# EAGLE board driver_board (EAGLE 6.4)
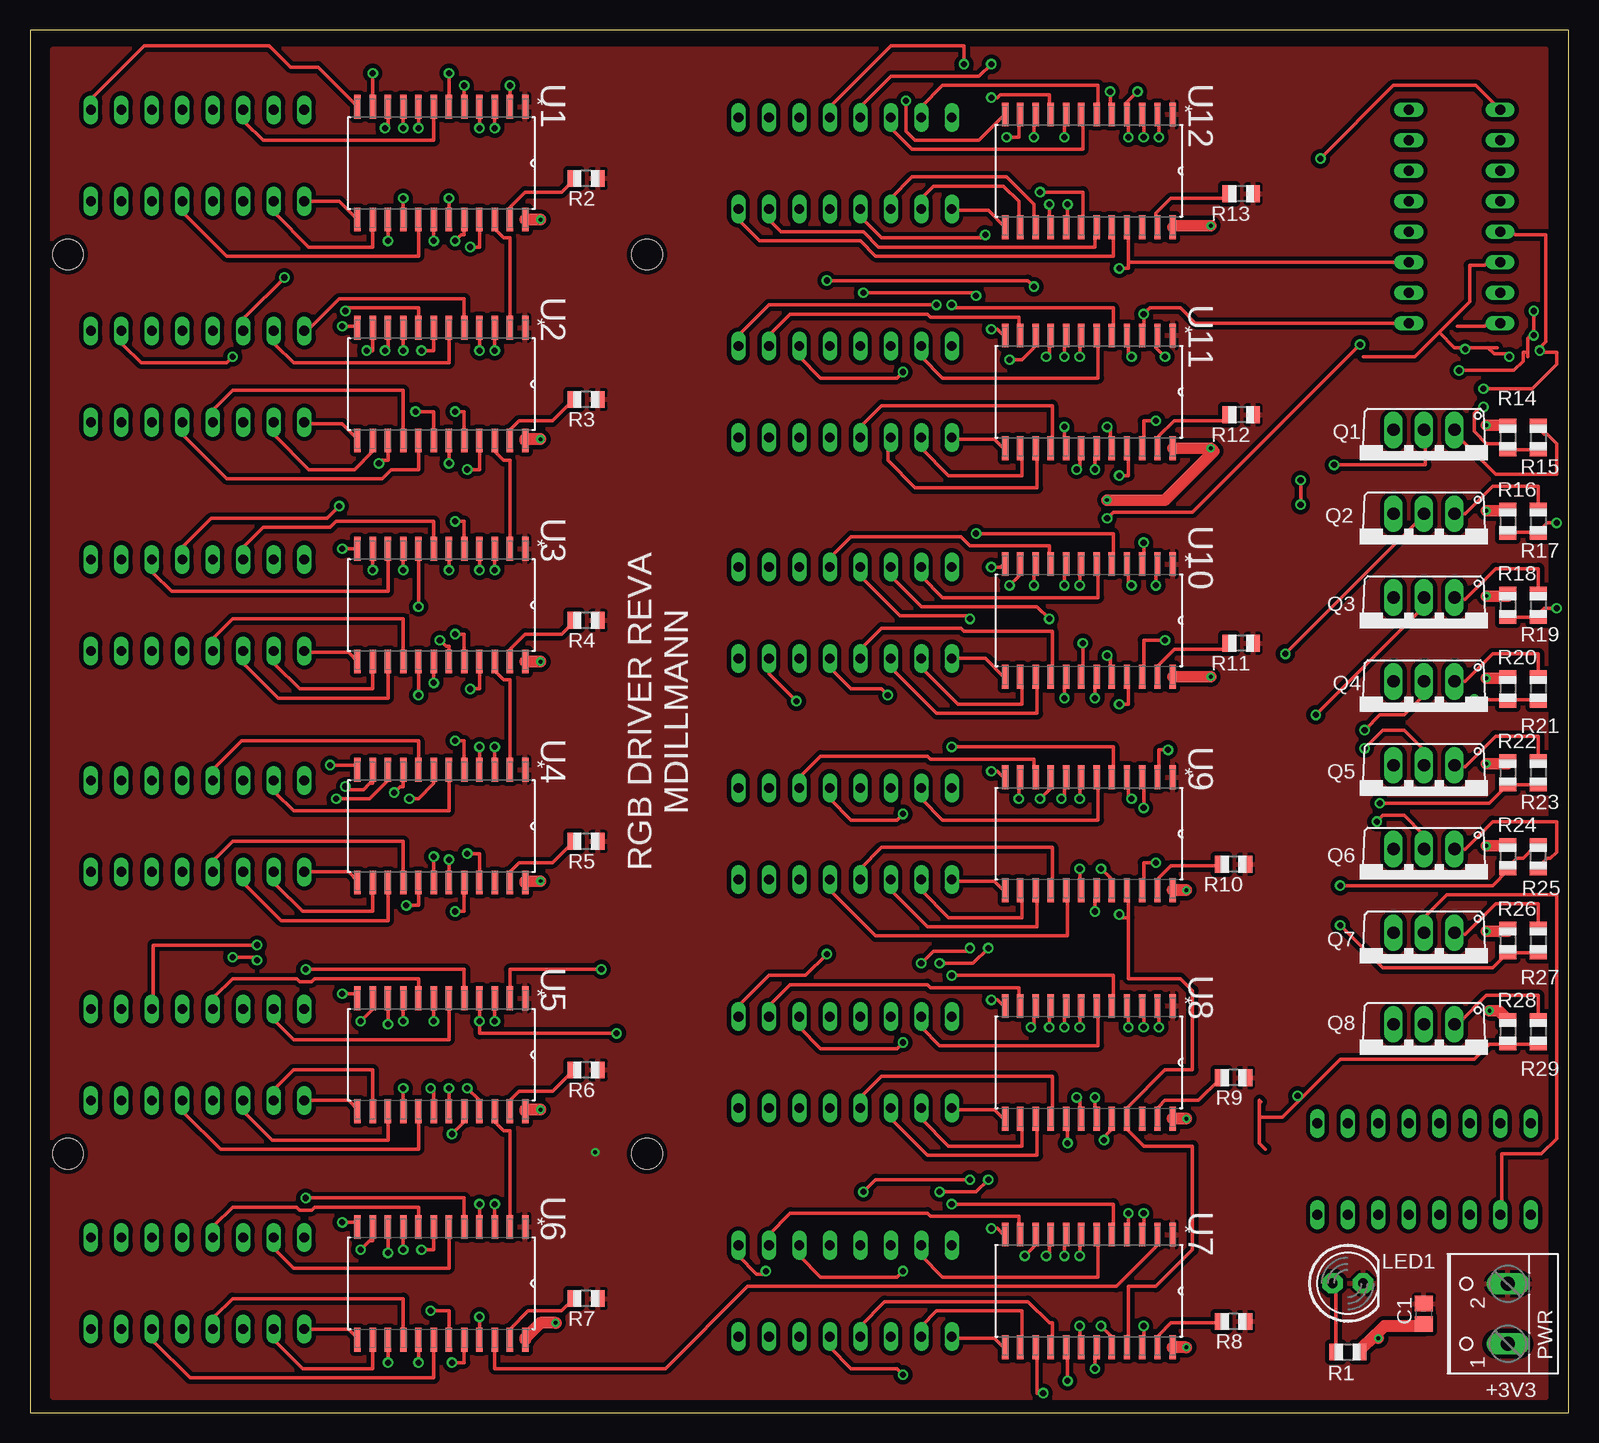
[diagram p2: board, top side]
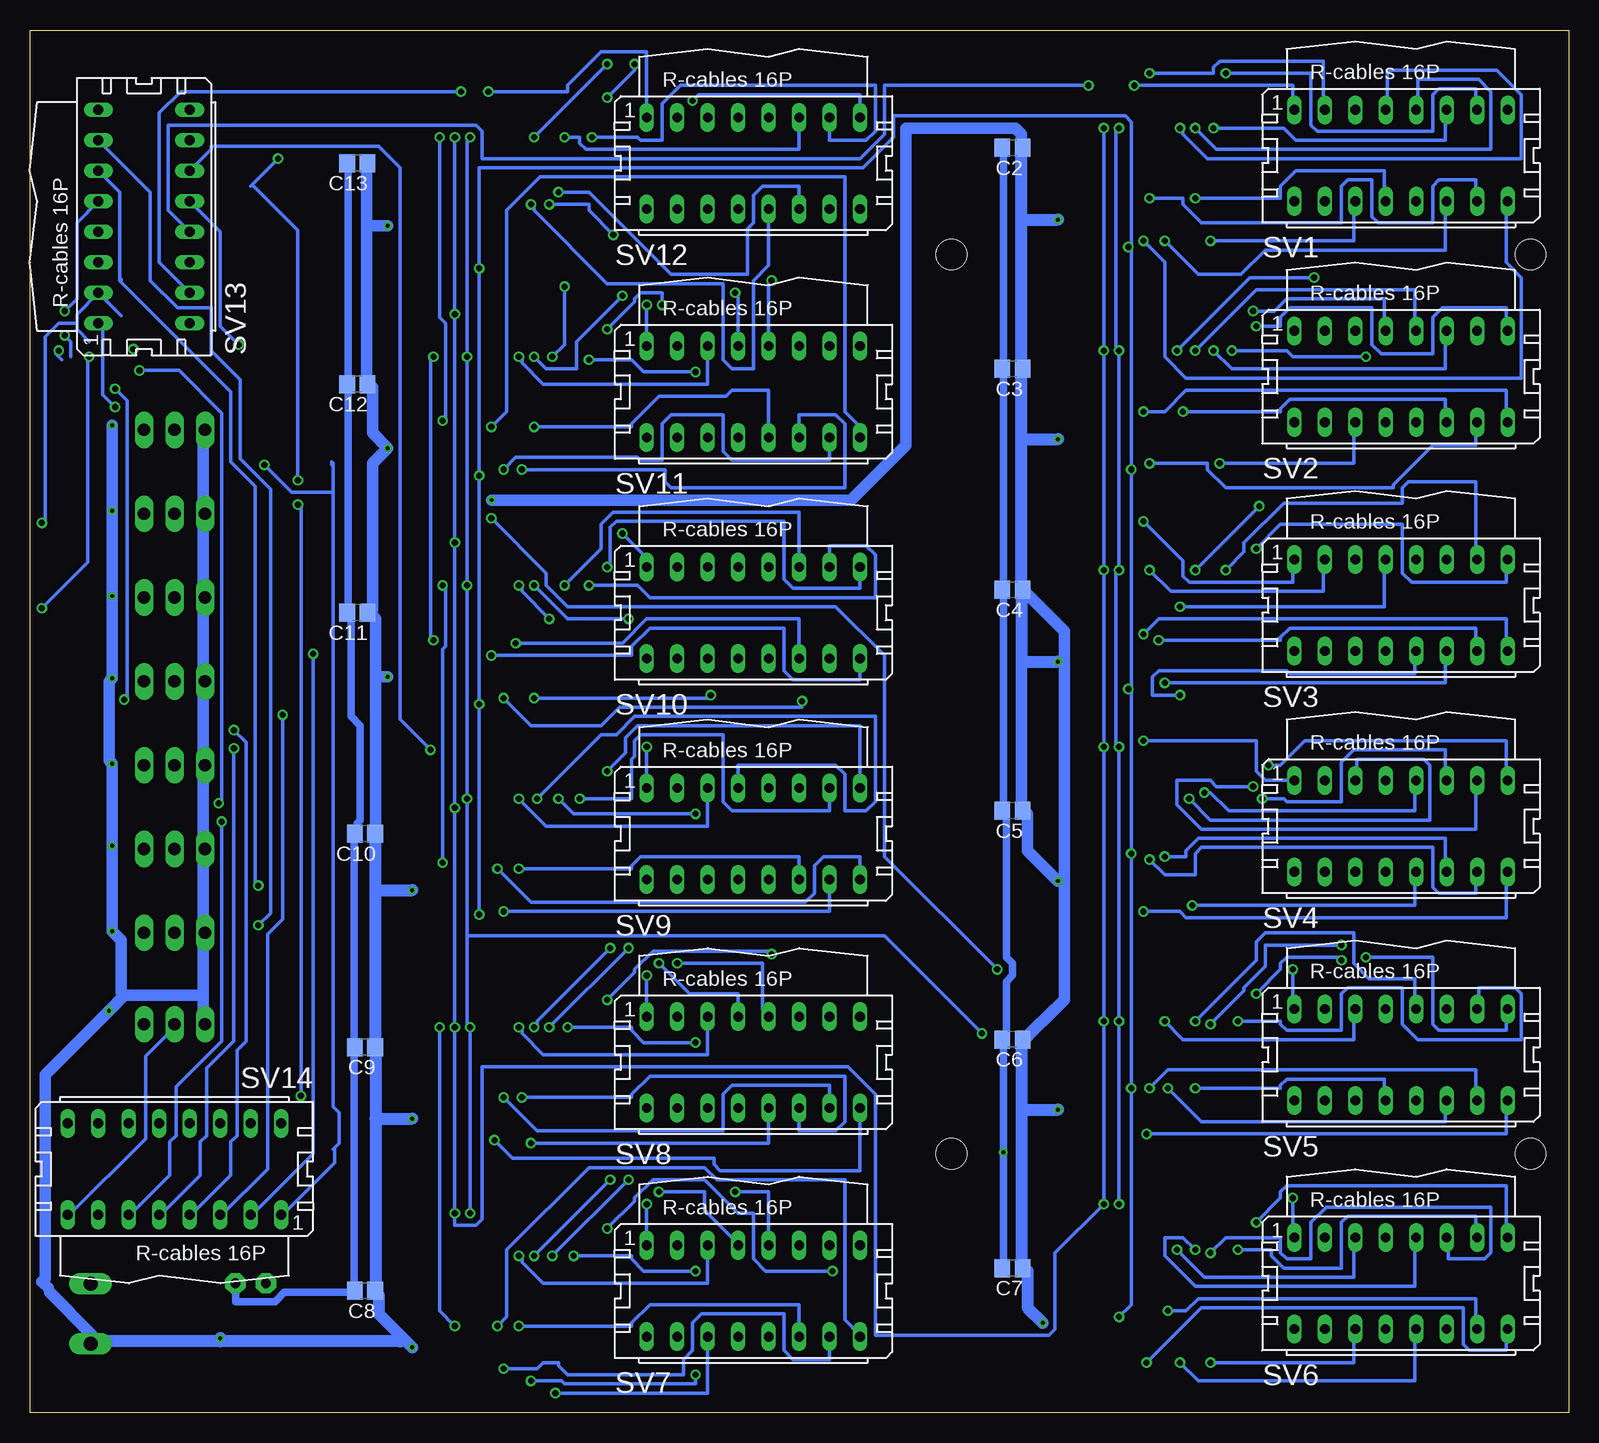
[diagram p3: board, bottom side, seen from below]

Size 128.25 x 115.24 mm. Coordinates in mm from the lower left corner, seen from the top.
Outline: 0,0 128.25,0 128.25,115.24 0,115.24 0,0
Copper layers (1*16): Top 0.0356mm / dielectric 1.5011mm / Bottom 0.0356mm
Design rules "LaenPCBOrder": minimum track width 6mil, minimum drill 13mil, track to track 6mil, track to pad 6mil, pad to pad 6mil, via to via 6mil, smd to smd 6mil, copper to edge 15mil, drill to drill 6mil, minimum pad ring 7mil, minimum via ring 7mil, stop-mask expansion 3mil, vias tented up to drill 0mil, thermal gap 10mil
Net classes: 0 default: width 0.305 mm, drill 0.508 mm, clearance 0.355 mm; 1 GND: width 0.61 mm, clearance 0.355 mm to class 0, clearance 0.355 mm; 2 +3V3: width 0.965 mm, clearance 0.355 mm to class 0, clearance 0.355 mm to class 1, clearance 0.355 mm
Holes 2.54 mm at 3.17,96.52 3.17,21.59 51.44,21.59 51.44,96.52

## Footprints (pad centres in the part's own frame; a part is rotated, then mirrored left to right if it is on the bottom)
C0805 = smd 1.3 x 1.5: 1 -0.85,0; 2 0.85,0
LED5MM = drill 0.813 pad 1.676 octagon: A -1.27,0; K 1.27,0
W237-102 = drill 1.194 long: 1 -2.5,-1.27; 2 2.5,-1.27
TO220AV = drill 1.016 long: B -2.54,-2.54; C 0,-2.54; E 2.54,-2.54
R0805 = smd 1.1 x 1.4: 1 -1,0; 2 1,0
16PL = drill 0.813 long: 1 -8.89,3.81; 2 -8.89,-3.81; 3 -6.35,3.81; 4 -6.35,-3.81; 5 -3.81,3.81; 6 -3.81,-3.81; 7 -1.27,3.81; 8 -1.27,-3.81; 9 1.27,3.81; 10 1.27,-3.81; 11 3.81,3.81; 12 3.81,-3.81; 13 6.35,3.81; 14 6.35,-3.81; 15 8.89,3.81; 16 8.89,-3.81
SOIC127P1032X265-24N = smd 1.981 x 0.533: 1 -4.699,6.985; 2 -4.699,5.715; 3 -4.699,4.445; 4 -4.699,3.175; 5 -4.699,1.905; 6 -4.699,0.635; 7 -4.699,-0.635; 8 -4.699,-1.905; 9 -4.699,-3.175; 10 -4.699,-4.445; 11 -4.699,-5.715; 12 -4.699,-6.985; 13 4.699,-6.985; 14 4.699,-5.715; 15 4.699,-4.445; 16 4.699,-3.175; 17 4.699,-1.905; 18 4.699,-0.635; 19 4.699,0.635; 20 4.699,1.905; 21 4.699,3.175; 22 4.699,4.445; 23 4.699,5.715; 24 4.699,6.985

## Placement (x,y rotation side)
C1  0.01  [C0805]  116.2,8.26 90 top
C2  [C0805]  46.35,105.41 180 bottom
C3  [C0805]  46.35,87 180 bottom
C4  [C0805]  46.35,68.58 180 bottom
C5  [C0805]  46.35,50.16 180 bottom
C6  [C0805]  46.35,31.11 180 bottom
C7  [C0805]  46.35,12.06 180 bottom
C8  [C0805]  100.33,10.16 180 bottom
C9  [C0805]  100.33,30.48 180 bottom
C10  [C0805]  100.33,48.26 180 bottom
C11  [C0805]  100.97,66.67 180 bottom
C12  [C0805]  100.97,85.72 180 bottom
C13  [C0805]  100.97,104.14 180 bottom
LED1  GREEN  [LED5MM]  109.86,10.79 0 top
PWR  [W237-102]  121.92,8.26 90 top
Q1  TIP32  [TO220AV]  116.2,79.38 180 top
Q2  TIP32  [TO220AV]  116.2,72.39 180 top
Q3  TIP32  [TO220AV]  116.2,65.41 180 top
Q4  TIP32  [TO220AV]  116.2,58.42 180 top
Q5  TIP32  [TO220AV]  116.2,51.44 180 top
Q6  TIP32  [TO220AV]  116.2,44.45 180 top
Q7  TIP32  [TO220AV]  116.2,37.47 180 top
Q8  TIP32  [TO220AV]  116.2,29.84 180 top
R1  220  [R0805]  109.86,5.08 0 top
R2  1K  [R0805]  46.35,102.87 180 top
R3  1K  [R0805]  46.35,84.45 180 top
R4  1K  [R0805]  46.35,66.04 180 top
R5  1K  [R0805]  46.35,47.62 180 top
R6  1K  [R0805]  46.35,28.57 180 top
R7  1K  [R0805]  46.35,9.53 180 top
R8  1K  [R0805]  100.33,7.62 180 top
R9  1K  [R0805]  100.33,27.94 180 top
R10  1K  [R0805]  100.33,45.72 180 top
R11  1K  [R0805]  100.97,64.14 180 top
R12  1K  [R0805]  100.97,83.19 180 top
R13  1K  [R0805]  100.97,101.6 180 top
R14  2K  [R0805]  123.19,81.28 270 top
R15  1K  [R0805]  125.73,81.28 270 top
R16  2K  [R0805]  123.19,74.3 270 top
R17  1K  [R0805]  125.73,74.3 270 top
R18  2K  [R0805]  123.19,67.31 270 top
R19  1K  [R0805]  125.73,67.31 270 top
R20  2K  [R0805]  123.19,60.33 270 top
R21  1K  [R0805]  125.73,60.33 270 top
R22  2K  [R0805]  123.19,53.34 270 top
R23  1K  [R0805]  125.73,53.34 270 top
R24  2K  [R0805]  123.19,46.35 270 top
R25  1K  [R0805]  125.73,46.35 90 top
R26  2K  [R0805]  123.19,39.37 270 top
R27  1K  [R0805]  125.73,39.37 270 top
R28  2K  [R0805]  123.19,31.75 270 top
R29  1K  [R0805]  125.73,31.75 270 top
SV1  [16PL]  13.97,104.78 0 bottom
SV2  [16PL]  13.97,86.36 0 bottom
SV3  [16PL]  13.97,67.31 0 bottom
SV4  [16PL]  13.97,48.9 0 bottom
SV5  [16PL]  13.97,29.84 0 bottom
SV6  [16PL]  13.97,10.79 0 bottom
SV7  [16PL]  67.94,10.16 0 bottom
SV8  [16PL]  67.94,29.21 0 bottom
SV9  [16PL]  67.94,48.26 0 bottom
SV10  [16PL]  67.94,66.67 0 bottom
SV11  [16PL]  67.94,85.09 0 bottom
SV12  [16PL]  67.94,104.14 0 bottom
SV13  [16PL]  118.75,99.69 90 bottom
SV14  [16PL]  116.2,20.32 180 bottom
U1  STP16CPP05MTR  [SOIC127P1032X265-24N]  34.29,104.14 270 top
U2  STP16CPP05MTR  [SOIC127P1032X265-24N]  34.29,85.72 270 top
U3  STP16CPP05MTR  [SOIC127P1032X265-24N]  34.29,67.31 270 top
U4  STP16CPP05MTR  [SOIC127P1032X265-24N]  34.29,48.9 270 top
U5  STP16CPP05MTR  [SOIC127P1032X265-24N]  34.29,29.84 270 top
U6  STP16CPP05MTR  [SOIC127P1032X265-24N]  34.29,10.79 270 top
U7  STP16CPP05MTR  [SOIC127P1032X265-24N]  88.27,10.16 270 top
U8  STP16CPP05MTR  [SOIC127P1032X265-24N]  88.27,29.21 270 top
U9  STP16CPP05MTR  [SOIC127P1032X265-24N]  88.27,48.26 270 top
U10  STP16CPP05MTR  [SOIC127P1032X265-24N]  88.27,66.04 270 top
U11  STP16CPP05MTR  [SOIC127P1032X265-24N]  88.27,85.09 270 top
U12  STP16CPP05MTR  [SOIC127P1032X265-24N]  88.27,103.5 270 top

## Tracks (layer width: path | path; a pad name or v marks a point on that pad's centre or on a via)
+3V3  (via drill 0.33)
  Top 0.965: U11.24 v98.42,80.39 98.68,80.14 94.61,76.07 v89.79,76.07 | v98.42,98.93 95.38,98.93 U12.24 | v98.42,61.34 U10.24 | v42.55,44.32 41.27,44.32 U4.24 | v121.67,33.53 122.43,33.53 123.19,32.77 R28.1 | v121.41,40.13 123.19,40.13 R26.1 | v121.41,47.24 123.19,47.24 R24.1 | v121.41,54.1 123.19,54.1 R22.1 | v121.41,61.21 123.19,61.21 R20.1 | v121.41,68.07 123.19,68.07 R18.1 | v121.41,75.18 123.19,75.18 R16.1 | v121.41,82.3 123.19,82.3 R14.1
  Top 1.016: v43.81,7.49 42.55,7.49 41.27,6.22 U6.24 | v42.55,25.27 41.27,25.27 U5.24 | v42.55,62.61 U3.24 | v42.55,81.15 41.27,81.15 U2.24 | v42.55,99.44 U1.24 | 112.14,6.48 112.9,7.24 116.2,7.24 C1.1 | 112.14,6.48 110.87,5.21 R1.2 | v96.39,5.46 U7.24 | v96.39,24.51 U8.24 | v96.39,43.56 U9.24 | v112.39,6.22 112.14,6.48
  Bottom 0.965: 100.2,98.93 100.2,104.01 C13.1 | 100.2,98.93 100.2,85.72 C12.1 99.69,85.47 99.69,81.66 v98.42,80.39 99.69,79.12 99.69,66.93 C11.1 99.95,66.67 99.44,66.17 99.44,61.34 | 100.2,98.93 v98.42,98.93 | 99.44,61.34 99.44,48.64 C10.1 | 99.44,61.34 v98.42,61.34 | PWR.1 123.06,6.48 126.62,10.03 126.75,10.41 127.25,10.92 127,11.18 127,28.19 v121.67,33.53 120.4,34.8 | v89.79,76.07 59.82,76.07 55.24,80.64 55.24,107.06 46.1,107.06 45.59,106.55 45.59,105.79 C2.1 | 45.59,62.61 45.59,50.16 C5.1 45.09,49.91 45.09,46.86 v42.55,44.32 | 42.8,33.66 42.04,34.42 42.04,65.15 45.34,68.45 C4.1 | 113.79,34.8 120.4,34.8 | 113.79,34.8 113.79,32.51 Q8.E | 120.4,34.8 120.65,35.05 120.65,39.37 v121.41,40.13 v121.41,47.24 v121.41,54.1 121.67,54.36 121.67,60.96 v121.41,61.21 v121.41,68.07 v121.41,75.18 v121.41,82.3 | 113.79,34.8 113.79,39.88 Q7.E 113.79,40.39 113.79,46.99 Q6.E 113.79,47.24 113.79,53.85 Q5.E 113.79,54.36 113.79,60.96 Q4.E 113.79,61.21 113.79,67.82 Q3.E 113.79,68.33 113.79,74.93 Q2.E 113.79,75.18 113.79,81.79 Q1.E
  Bottom 1.016: 45.59,25.27 45.59,31.11 C6.1 45.09,31.37 42.8,33.66 | 45.59,25.27 45.59,12.06 C7.1 45.09,11.81 45.09,8.76 v43.81,7.49 | 45.59,25.27 v42.55,25.27 | 45.59,81.15 45.59,68.96 C4.1 45.59,68.45 45.59,62.61 v42.55,62.61 | 45.59,81.15 45.59,87 C3.1 45.59,87.25 45.59,99.44 | 45.59,99.44 45.59,105.28 C2.1 | 45.59,81.15 v42.55,81.15 | 45.59,99.44 v42.55,99.44 | 99.44,24.51 99.44,30.35 C9.1 99.44,30.86 99.44,43.56 | 99.44,24.51 99.44,10.29 C8.1 99.19,9.78 99.19,8.26 97.16,6.22 | 99.44,43.56 99.44,48.13 C10.1 | 97.16,6.22 v96.39,5.46 | 99.44,24.51 v96.39,24.51 | 99.44,43.56 v96.39,43.56 | 112.39,5.97 97.41,5.97 97.16,6.22 | 112.39,5.97 123.06,5.97 PWR.1 | v112.39,6.22 112.39,5.97
CLK  (via drill 0.51)
  Top 0.305: v38.73,17.4 U6.3 | U5.3 v38.73,32.64 | v38.73,70.23 U3.3 | v38.73,88.52 U2.3 | v38.73,107.06 U1.3 | v92.84,16.64 92.84,14.86 U7.3 | v92.84,32.13 92.84,33.91 U8.3 | v92.84,50.42 92.84,52.96 U9.3 | v92.84,72.52 92.84,70.74 U10.3 | U11.3 92.84,89.79 v92.84,91.57 93.34,92.08 95.89,92.08 97.16,90.81 SV13.2 | v92.84,106.3 92.84,108.08 U12.3 | v38.73,55.5 U4.3
  Bottom 0.305: v38.73,107.06 v38.73,88.52 v38.73,70.23 v38.73,55.5 v38.73,32.64 v38.73,17.4 42.8,13.34 42.8,6.99 43.31,6.48 57.78,6.48 57.78,26.54 60.07,28.83 90.55,28.83 90.55,16.13 91.06,15.62 92.84,15.62 v92.84,16.64 v92.84,32.13 v92.84,50.42 v92.84,72.52 v92.84,91.57 v92.84,106.3
GND  (via drill 0.33)
  Bottom 0.61: C7.2 47.12,12.06 v47.12,21.72 47.12,31.11 C6.2 47.12,31.37 46.86,31.62 46.86,35.94 46.35,36.45 46.35,37.47 46.86,37.97 46.86,49.91 47.12,50.16 C5.2 47.12,50.42 47.12,68.2 C4.2 | 47.12,68.45 C4.2 | C2.2 47.12,105.28 47.12,87 C3.2 47.12,86.74 47.12,68.71 C4.2 | C13.2 101.73,104.01 101.73,85.98 C12.2 101.73,85.72 101.73,66.67 C11.2 101.73,66.42 101.47,66.17 101.47,58.04 100.71,57.28 100.71,49.4 100.97,49.15 100.97,48.39 C10.2 101.22,48.13 101.22,30.61 C9.2 101.22,30.35 101.22,10.29 C8.2 101.22,10.03 107.06,10.03 107.82,9.27 111.12,9.27 LED1.K
  pour Top: 1.91,113.67 126.36,113.67 126.36,1.27 1.91,1.27
LE  (via drill 0.51)
  Top 0.305: v37.47,17.4 U6.4 | U5.4 v37.47,32.64 37.47,31.62 v48.9,31.62 | v37.47,70.23 U3.4 | v37.47,88.52 U2.4 | v37.47,107.06 U1.4 | v91.57,16.64 91.57,14.86 U7.4 | v91.57,32.13 91.57,33.91 U8.4 | v91.82,51.18 91.57,51.18 91.57,52.96 U9.4 | v91.82,68.96 91.57,68.96 91.57,70.74 U10.4 | v91.82,88.01 91.57,88.01 91.57,89.79 U11.4 | v91.57,106.3 91.57,108.08 U12.4 91.31,108.33 91.31,109.09 v92.33,110.11 | v37.47,55.5 U4.4
  Bottom 0.305: v37.47,17.4 v37.47,32.64 v37.47,55.5 37.72,55.75 37.72,69.98 v37.47,70.23 v37.47,88.52 37.72,88.77 37.72,106.81 v37.47,107.06 | v91.57,16.64 v91.57,32.13 91.82,32.38 91.82,39.75 | 91.82,39.75 v91.82,51.18 v91.82,68.96 v91.82,88.01 91.82,106.05 v91.57,106.3 | SV13.4 117.47,95.89 117.47,108.33 115.7,110.11 v92.33,110.11 | v48.9,31.62 57.02,39.75 91.82,39.75
N$1  (via drill 0.51)
  Top 0.305: v36.2,110.62 U1.5
  Bottom 0.305: v36.2,110.62 22.99,110.62 22.99,108.58 SV1.1
N$2
  Top 0.305: U1.7 33.66,106.05 19.43,106.05 17.91,107.57 17.91,108.58 SV1.5
N$3  (via drill 0.51)
  Top 0.305: v34.92,111.63 U1.6
  Bottom 0.305: v34.92,111.63 29.59,111.63 29.59,112.14 29.08,112.65 20.45,112.65 20.45,108.58 SV1.3
N$4  (via drill 0.51)
  Top 0.305: v32.38,107.06 U1.8
  Bottom 0.305: v32.38,107.06 32.13,106.81 32.13,106.55 30.1,104.52 3.94,104.52 3.94,109.86 5.97,111.89 15.11,111.89 15.11,108.58 SV1.7
N$5  (via drill 0.51)
  Top 0.305: U1.10 29.84,107.06 v29.59,107.06
  Bottom 0.305: v29.59,107.06 23.75,107.06 22.73,106.05 10.29,106.05 10.29,108.58 SV1.11
N$6  (via drill 0.51)
  Top 0.305: v28.57,111.63 U1.11
  Bottom 0.305: v28.57,111.63 21.46,111.63 21.46,107.31 20.95,106.81 11.3,106.81 11.3,109.86 10.79,110.36 7.75,110.36 7.75,108.58 SV1.13
N$7  (via drill 0.51)
  Top 0.305: v31.11,107.06 U1.9
  Bottom 0.305: v31.11,107.06 29.34,105.28 6.48,105.28 6.48,110.11 7.49,111.12 12.57,111.12 12.57,108.58 SV1.9
N$8
  Top 0.305: U1.12 24,112.14 21.72,112.14 19.94,113.92 9.53,113.92 5.21,109.6 5.21,108.58 SV1.15
N$9
  Top 0.305: U1.13 25.78,100.97 SV1.2
N$10
  Top 0.305: U1.14 28.57,97.16 23.24,97.16 20.45,99.95 20.45,100.97 SV1.4
N$11  (via drill 0.51)
  Top 0.305: v29.84,97.66 U1.15
  Bottom 0.305: v29.84,97.66 17.91,97.66 17.91,100.97 SV1.6
N$12  (via drill 0.51)
  Top 0.305: v31.11,101.22 U1.16
  Bottom 0.305: v31.11,101.22 24,101.22 24,102.23 22.73,103.5 15.37,103.5 15.37,100.97 SV1.8
N$13
  Top 0.305: U1.17 32.38,96.39 16.38,96.39 12.83,99.95 12.83,100.97 SV1.10
N$14  (via drill 0.51)
  Top 0.305: v33.66,97.66 U1.18
  Bottom 0.305: v33.66,97.66 30.86,94.87 27.3,94.87 25.27,96.9 10.29,96.9 10.29,100.97 SV1.12
N$15  (via drill 0.51)
  Top 0.305: v34.92,101.22 U1.19
  Bottom 0.305: v34.92,101.22 32.13,101.22 32.13,100.71 30.61,99.19 18.92,99.19 18.92,102.23 18.41,102.74 16.38,102.74 16.38,99.69 15.88,99.19 11.3,99.19 11.3,102.23 10.79,102.74 7.75,102.74 7.75,100.97 SV1.14
N$16  (via drill 0.51)
  Top 0.305: U1.20 36.2,98.17 35.94,98.17 v35.43,97.66
  Bottom 0.305: v35.43,97.66 33.66,95.89 33.66,88.01 31.88,86.23 3.94,86.23 3.94,94.61 5.21,95.89 5.21,100.97 SV1.16
N$18
  Top 0.305: U8.13 81.15,24.51 80.39,25.27 76.83,25.27 SV8.2
N$19
  Top 0.305: U1.23 40.01,100.46 41.27,101.73 44.32,101.73 45.34,102.74 R2.2
N$20
  Top 0.305: SV8.4 74.3,24.51 76.58,22.23 82.68,22.23 82.68,24.51 U8.14
N$21
  Top 0.305: SV8.8 69.22,26.29 70.99,28.07 85.22,28.07 85.22,24.51 U8.16
N$22
  Top 0.305: SV8.6 71.75,24.51 74.8,21.46 83.95,21.46 83.95,24.51 U8.15
N$23  (via drill 0.51)
  Top 0.305: v86.49,22.48 86.49,24.51 U8.17
  Bottom 0.305: v86.49,22.48 66.67,22.48 SV8.10
N$24  (via drill 0.51)
  Top 0.305: v87.25,26.29 87.5,26.29 87.5,24.51 U8.18
  Bottom 0.305: v87.25,26.29 78.11,26.29 78.11,26.54 76.58,28.07 60.33,28.07 60.33,24.26 61.09,23.5 64.14,23.5 SV8.12
N$25  (via drill 0.51)
  Top 0.305: v88.77,26.29 88.77,24.51 U8.19
  Bottom 0.305: v88.77,26.29 85.98,23.5 70.48,23.5 70.48,26.54 69.72,27.3 61.59,27.3 SV8.14
N$26  (via drill 0.51)
  Top 0.305: v89.53,22.73 89.53,22.99 90.04,23.5 90.04,24.51 U8.20
  Bottom 0.305: v89.53,22.73 88.01,21.21 71.25,21.21 71.25,20.7 70.74,20.19 59.05,20.19 SV8.16
N$27
  Top 0.305: U2.5 36.2,92.84 25.78,92.84 23.24,90.3 22.99,90.3 SV2.1
N$28
  Top 0.305: U2.6 34.92,87.5 21.97,87.5 20.45,89.03 20.45,90.04 SV2.3
N$29  (via drill 0.51)
  Top 0.305: U2.7 33.66,88.52 v32.64,88.52 | v21.21,94.61 17.91,91.31 17.91,90.3 SV2.5
  Bottom 0.305: v32.64,88.52 26.54,94.61 v21.21,94.61
N$30  (via drill 0.51)
  Top 0.305: U2.8 32.38,92.08 26.54,92.08 v26.29,91.82
  Bottom 0.305: v26.29,91.82 24.51,91.82 23.5,92.84 15.37,92.84 15.37,90.3 SV2.7
N$31  (via drill 0.51)
  Top 0.305: U2.10 29.84,88.52 v29.59,88.52
  Bottom 0.305: v29.59,88.52 28.07,87 10.29,87 10.29,90.04 SV2.11
N$32  (via drill 0.51)
  Top 0.305: v31.11,88.52 U2.9
  Bottom 0.305: v31.11,88.52 26.04,93.6 12.83,93.6 12.83,90.3 SV2.9
N$33  (via drill 0.51)
  Top 0.305: U2.11 28.57,88.52 v28.07,88.52 | v16.89,88.01 16.38,87.5 9.27,87.5 7.75,89.03 7.75,90.04 SV2.13
  Bottom 0.305: v28.07,88.52 23.5,88.52 22.99,88.01 v16.89,88.01
N$34  (via drill 0.51)
  Top 0.305: v26.04,90.55 27.3,90.55 U2.12
  Bottom 0.305: v26.04,90.55 24,90.55 24,91.31 23.24,92.08 16.38,92.08 16.38,89.03 15.62,88.27 11.3,88.27 11.3,91.31 10.54,92.08 5.21,92.08 5.21,90.3 SV2.15
N$36
  Top 0.305: U2.23 40.01,81.92 40.77,82.68 43.56,82.68 45.34,84.45 R3.2
N$37  (via drill 0.51)
  Top 0.305: U5.5 36.2,36.96 v22.99,36.96
  Bottom 0.305: v22.99,36.96 22.99,33.66 SV5.1
N$38
  Top 0.305: U5.6 34.92,31.11 21.97,31.11 20.45,32.64 20.45,33.66 SV5.3
N$39  (via drill 0.51)
  Top 0.305: v33.66,32.64 U5.7
  Bottom 0.305: v33.66,32.64 32.13,31.11 17.91,31.11 17.91,33.66 SV5.5
N$40
  Top 0.305: U5.8 32.38,36.2 23.75,36.2 23.5,35.94 22.48,35.94 22.23,36.2 16.89,36.2 15.37,34.67 15.37,33.66 SV5.7
N$41  (via drill 0.51)
  Top 0.305: v29.84,32.38 U5.10 | v18.92,38.99 10.29,38.99 10.29,33.66 SV5.11
  Bottom 0.305: v29.84,32.38 27.05,35.18 27.05,35.43 25.27,37.21 25.27,38.99 v18.92,38.99 | 10.29,33.66 SV5.11
N$42  (via drill 0.51)
  Top 0.305: v31.11,32.64 U5.9 | 12.83,34.67 12.83,33.66 SV5.9
  Bottom 0.305: v31.11,32.64 26.04,37.72 26.04,39.24 25.27,40.01 17.91,40.01 17.91,37.47 16.64,36.2 12.83,36.2 12.83,33.66 SV5.9
N$43  (via drill 0.51)
  Top 0.305: U5.11 28.57,33.66 v27.56,32.64
  Bottom 0.305: v27.56,32.64 24,32.64 24,32.38 23.5,31.88 18.92,31.88 18.92,34.92 18.41,35.43 13.84,35.43 13.84,32.38 12.57,31.11 3.94,31.11 3.94,34.92 4.45,35.43 7.49,35.43 7.49,33.66 SV5.13
N$44  (via drill 0.51)
  Top 0.305: v26.04,34.92 27.05,34.92 27.3,34.67 U5.12 | v18.92,37.72 18.67,37.97 v16.89,37.97
  Bottom 0.305: v26.04,34.92 24,36.96 24,37.47 23.5,37.97 18.92,37.97 v18.92,37.72 | SV5.15 5.21,33.66 5.21,31.88 10.79,31.88 11.3,32.38 11.3,37.97 v16.89,37.97
N$45
  Top 0.305: SV5.2 26.54,26.04 27.3,25.27 U5.13
N$46
  Top 0.305: U5.14 28.57,28.57 21.97,28.57 20.45,27.05 20.45,26.04 SV5.4
N$47
  Top 0.305: U5.15 29.84,22.73 20.19,22.73 17.91,25.02 17.91,26.04 SV5.6
N$48  (via drill 0.51)
  Top 0.305: v31.11,27.05 U5.16
  Bottom 0.305: v31.11,27.05 24,27.05 24,27.3 23.5,27.81 15.37,27.81 15.37,26.04 SV5.8
N$49
  Top 0.305: U5.17 32.38,21.97 15.88,21.97 12.83,25.02 12.83,26.04 SV5.10
N$50  (via drill 0.51)
  Top 0.305: U5.18 33.66,27.05 v33.4,27.05
  Bottom 0.305: v33.4,27.05 30.61,24.26 10.29,24.26 10.29,26.04 SV5.12
N$51  (via drill 0.51)
  Top 0.305: v34.92,27.05 U5.19
  Bottom 0.305: v34.92,27.05 33.4,28.57 7.75,28.57 7.75,26.04 SV5.14
N$52  (via drill 0.51)
  Top 0.305: U5.20 36.2,24.26 v35.18,23.24
  Bottom 0.305: v35.18,23.24 5.21,23.24 5.21,26.04 SV5.16
N$54
  Top 0.305: U3.23 40.01,63.63 41.27,64.9 44.32,64.9 45.34,65.91 R4.2
N$55  (via drill 0.51)
  Top 0.305: U6.5 36.2,17.91 v22.99,17.91
  Bottom 0.305: v22.99,17.91 22.99,14.61 SV6.1
N$56
  Top 0.305: U6.6 34.92,12.06 21.97,12.06 20.45,13.59 20.45,14.61 SV6.3
N$57  (via drill 0.51)
  Top 0.305: U6.7 33.66,13.59 v32.64,13.59
  Bottom 0.305: v32.64,13.59 30.35,11.3 17.91,11.3 17.91,14.61 SV6.5
N$58
  Top 0.305: U6.8 32.38,17.14 23.75,17.14 23.5,16.89 22.48,16.89 22.23,17.14 16.89,17.14 15.37,15.62 15.37,14.61 SV6.7
N$59  (via drill 0.51)
  Top 0.305: v29.84,13.34 U6.10
  Bottom 0.305: v29.84,13.34 28.57,14.61 24,14.61 24,13.34 23.5,12.83 21.46,12.83 21.46,15.88 20.19,17.14 6.48,17.14 6.48,13.34 6.99,12.83 10.03,12.83 10.03,14.61 SV6.11
N$60  (via drill 0.51)
  Top 0.305: v31.11,13.59 U6.9
  Bottom 0.305: v31.11,13.59 32.13,14.61 33.66,14.61 33.66,13.08 31.11,10.54 12.83,10.54 12.83,14.61 SV6.9
N$61  (via drill 0.51)
  Top 0.305: U6.11 28.57,14.35 28.32,14.35 v27.56,13.59
  Bottom 0.305: v27.56,13.59 24.77,13.59 24.77,13.08 23.75,12.06 18.92,12.06 18.92,15.88 18.41,16.38 7.75,16.38 7.75,14.61 SV6.13
N$62  (via drill 0.51)
  Top 0.305: v26.04,15.88 27.05,15.88 27.3,15.62 U6.12
  Bottom 0.305: v26.04,15.88 24,17.91 24,18.41 23.5,18.92 5.21,18.92 5.21,14.61 SV6.15
N$63
  Top 0.305: SV6.2 26.54,6.99 27.3,6.22 U6.13
N$64
  Top 0.305: U6.14 28.57,3.68 22.73,3.68 20.45,5.97 20.45,6.99 SV6.4
N$65  (via drill 0.51)
  Top 0.305: v29.84,4.19 U6.15
  Bottom 0.305: v29.84,4.19 17.91,4.19 17.91,6.99 SV6.6
N$66
  Top 0.305: U6.16 31.11,9.53 16.89,9.53 15.37,8 15.37,6.99 SV6.8
N$67  (via drill 0.51)
  Top 0.305: v32.38,4.19 U6.17
  Bottom 0.305: v32.38,4.19 30.86,2.67 12.83,2.67 12.83,6.99 SV6.10
N$68
  Top 0.305: U6.18 33.66,2.92 13.34,2.92 10.29,5.97 10.29,6.99 SV6.12
N$69  (via drill 0.51)
  Top 0.305: U6.19 34.92,8.51 v33.4,8.51
  Bottom 0.305: v33.4,8.51 31.88,8.51 30.86,9.53 7.75,9.53 7.75,6.99 SV6.14
N$70  (via drill 0.51)
  Top 0.305: U6.20 36.2,4.19 v35.18,4.19
  Bottom 0.305: v35.18,4.19 30.61,8.76 8.76,8.76 8.76,5.71 8.26,5.21 5.21,5.21 5.21,6.99 SV6.16
N$72
  Top 0.305: U4.23 40.01,45.09 40.77,45.85 43.56,45.85 45.34,47.62 R5.2
N$73  (via drill 0.51)
  Top 0.305: v76.83,17.4 90.3,17.4 90.3,14.86 U7.5
  Bottom 0.305: SV7.1 v76.83,17.4
N$74
  Top 0.305: SV7.3 74.3,13.08 76.07,11.3 89.03,11.3 89.03,14.86 U7.6
N$75  (via drill 0.51)
  Top 0.305: v87.5,13.08 87.5,14.86 U7.7
  Bottom 0.305: v87.5,13.08 87.25,12.83 87.25,12.57 85.47,10.79 71.75,10.79 SV7.5
N$76  (via drill 0.51)
  Top 0.305: v86.23,13.08 86.23,14.86 U7.8 | v79.88,19.43 78.87,18.41 v75.82,18.41
  Bottom 0.305: v79.88,19.43 v86.23,13.08 | v75.82,18.41 72.01,18.41 72.01,16.89 69.22,14.1 SV7.7
N$77  (via drill 0.51)
  Top 0.305: v82.93,13.08 83.69,13.84 83.69,14.86 U7.10 | v72.77,11.81 72.26,11.3 65.91,11.3 64.14,13.08 SV7.11
  Bottom 0.305: v82.93,13.08 78.11,13.08 78.11,12.83 77.09,11.81 v72.77,11.81
N$78  (via drill 0.51)
  Top 0.305: v84.71,13.08 84.96,13.08 84.96,14.86 U7.9 | v78.36,19.43 70.48,19.43 v69.47,18.41
  Bottom 0.305: v78.36,19.43 v84.71,13.08 | v69.47,18.41 66.67,18.41 SV7.9
N$79
  Top 0.305: SV7.13 61.59,14.86 63.37,16.64 74.8,16.64 75.06,16.38 82.42,16.38 82.42,14.86 U7.11
N$80  (via drill 0.51)
  Top 0.305: v80.14,15.37 80.64,15.37 81.15,14.86 U7.12 | v61.34,11.81 61.09,11.56 60.58,11.56 59.05,13.08 SV7.15
  Bottom 0.305: v80.14,15.37 77.85,17.65 77.85,17.91 76.33,19.43 72.01,19.43 69.22,16.64 67.94,16.64 67.94,12.83 66.93,11.81 v61.34,11.81
N$81
  Top 0.305: U7.13 81.15,5.46 80.39,6.22 76.83,6.22 SV7.2
N$82
  Top 0.305: SV7.4 74.3,7.24 75.56,8.51 82.68,8.51 82.68,5.46 U7.14
N$83  (via drill 0.51)
  Top 0.305: v84.45,1.65 83.95,1.65 83.95,5.46 U7.15
  Bottom 0.305: v84.45,1.65 71.75,1.65 SV7.6
N$84
  Top 0.305: SV7.8 69.22,7.24 71.25,9.27 83.19,9.27 84.96,7.49 85.22,7.49 85.22,5.46 U7.16
N$85  (via drill 0.51)
  Top 0.305: v86.49,2.67 86.49,5.46 U7.17 | v72.77,3.17 72.26,3.68 68.45,3.68 66.67,5.46 SV7.10
  Bottom 0.305: v86.49,2.67 83.95,2.67 83.69,2.41 72.77,2.41 v72.77,3.17
N$86  (via drill 0.51)
  Top 0.305: v87.5,7.24 87.5,5.46 U7.18
  Bottom 0.305: v87.5,7.24 78.11,7.24 78.11,7.49 76.58,9.02 64.14,9.02 SV7.12
N$87  (via drill 0.51)
  Top 0.305: v88.77,3.68 88.77,5.46 U7.19
  Bottom 0.305: v88.77,3.68 85.98,3.68 85.47,4.19 84.2,4.19 84.2,3.94 83.44,3.17 73.79,3.17 73.79,4.45 73.03,5.21 73.03,7.49 72.26,8.26 65.41,8.26 65.41,5.21 64.64,4.45 61.59,4.45 SV7.14
N$88  (via drill 0.51)
  Top 0.305: v89.28,7.24 90.04,6.48 90.04,5.46 U7.20
  Bottom 0.305: v89.28,7.24 88.52,8 88.52,13.59 81.66,20.45 72.01,20.45 70.99,19.43 60.33,19.43 60.33,7.75 59.05,6.48 SV7.16
N$90
  Top 0.305: U5.23 40.01,26.04 40.77,26.8 43.56,26.8 45.34,28.57 R6.2
N$91  (via drill 0.51)
  Top 0.305: v76.83,36.45 90.3,36.45 90.3,33.91 U8.5
  Bottom 0.305: SV8.1 v76.83,36.45
N$92
  Top 0.305: SV8.3 74.3,32.13 75.82,30.61 89.03,30.61 89.03,33.91 U8.6
N$93  (via drill 0.51)
  Top 0.305: v87.5,32.13 87.5,33.91 U8.7
  Bottom 0.305: v87.5,32.13 87.25,31.88 87.25,31.62 85.47,29.84 71.75,29.84 SV8.5
N$94  (via drill 0.51)
  Top 0.305: v86.23,32.13 86.23,33.91 U8.8 | v79.88,38.73 78.61,37.47 v75.82,37.47
  Bottom 0.305: v86.23,32.13 85.98,32.38 85.98,32.64 v79.88,38.73 | v75.82,37.47 73.28,34.92 69.22,34.92 SV8.7
N$95  (via drill 0.51)
  Top 0.305: v83.44,32.13 83.69,32.13 83.69,33.91 U8.10 | v72.77,30.86 72.26,30.35 65.91,30.35 64.14,32.13 SV8.11
  Bottom 0.305: v83.44,32.13 78.11,32.13 78.11,31.88 77.09,30.86 v72.77,30.86
N$96  (via drill 0.51)
  Top 0.305: v84.96,32.13 84.96,33.91 U8.9 | v78.36,38.73 78.11,38.48 75.31,38.48 v74.3,37.47
  Bottom 0.305: v78.36,38.73 v84.96,32.13 | v74.3,37.47 67.18,37.47 67.18,33.66 66.67,33.15 SV8.9
N$97
  Top 0.305: SV8.13 61.59,33.91 63.37,35.69 74.8,35.69 75.06,35.43 82.42,35.43 82.42,33.91 U8.11
N$98  (via drill 0.51)
  Top 0.305: v80.14,34.42 80.64,34.42 81.15,33.91 U8.12 | v66.42,38.23 64.64,36.45 61.59,36.45 59.05,33.91 SV8.15
  Bottom 0.305: v80.14,34.42 77.85,36.7 77.85,36.96 76.33,38.48 66.42,38.48 v66.42,38.23
N$99
  Top 0.305: U2.13 27.3,81.15 26.04,82.42 22.99,82.42 SV2.2
N$100
  Top 0.305: U2.14 28.57,80.14 27.05,78.61 23.24,78.61 20.45,81.41 20.45,82.42 SV2.4
N$101  (via drill 0.51)
  Top 0.305: U2.15 29.84,79.38 29.34,79.38 v29.08,79.12
  Bottom 0.305: v29.08,79.12 17.91,79.12 17.91,82.42 SV2.6
N$102
  Top 0.305: U2.16 31.11,85.22 16.89,85.22 15.37,83.69 15.37,82.68 SV2.8
N$103  (via drill 0.51)
  Top 0.305: U2.18 33.66,83.44 v32.13,83.44
  Bottom 0.305: v32.13,83.44 24,83.44 24,83.69 23.24,84.45 10.29,84.45 10.29,82.68 SV2.12
N$104  (via drill 0.51)
  Top 0.305: v34.92,79.12 U2.19
  Bottom 0.305: v34.92,79.12 30.1,79.12 30.1,78.61 28.57,77.09 14.61,77.09 14.61,77.34 11.3,80.64 7.75,80.64 7.75,82.42 SV2.14
N$105  (via drill 0.51)
  Top 0.305: U2.20 36.2,83.44 v35.43,83.44
  Bottom 0.305: v35.43,83.44 33.66,83.44 31.88,85.22 5.21,85.22 5.21,82.68 SV2.16
N$106
  Top 0.305: U2.17 32.38,78.61 30.1,78.61 29.34,77.85 16.38,77.85 12.83,81.41 12.83,82.42 SV2.10
N$107  (via drill 0.51)
  Top 0.305: U3.5 36.2,74.3 v35.43,74.3
  Bottom 0.305: v35.43,74.3 32.13,70.99 32.13,69.72 31.62,69.22 22.99,69.22 22.99,70.99 SV3.1
N$108
  Top 0.305: U6.23 40.01,6.99 41.53,8.51 44.32,8.51 45.34,9.53 R7.2
N$109  (via drill 0.51)
  Top 0.305: v34.92,70.23 U3.6
  Bottom 0.305: v34.92,70.23 33.15,68.45 20.45,68.45 20.45,70.99 SV3.3
N$110
  Top 0.305: U3.7 33.66,74.3 25.53,74.3 25.02,73.79 19.43,73.79 17.91,72.26 17.91,71.25 SV3.5
N$111  (via drill 0.51)
  Top 0.305: v32.38,67.18 U3.8
  Bottom 0.305: v32.38,67.18 15.37,67.18 15.37,70.99 SV3.7
N$112  (via drill 0.51)
  Top 0.305: v31.11,70.23 U3.9 | v25.78,75.56 24.77,74.55 15.11,74.55 12.83,72.26 12.83,71.25 SV3.9
  Bottom 0.305: v25.78,75.56 v31.11,70.23
N$113
  Top 0.305: U3.10 29.84,68.45 11.81,68.45 10.29,69.98 10.29,70.99 SV3.11
N$114  (via drill 0.51)
  Top 0.305: v28.57,70.23 U3.11
  Bottom 0.305: v28.57,70.23 27.05,71.75 27.05,72.52 23.75,75.82 13.84,75.82 13.84,77.09 13.34,77.6 7.75,77.6 7.75,71.25 SV3.13
N$115  (via drill 0.51)
  Top 0.305: v26.04,72.01 U3.12
  Bottom 0.305: v26.04,72.01 24,74.04 13.84,74.04 13.84,69.98 13.08,69.22 5.21,69.22 5.21,70.99 SV3.15
N$116
  Top 0.305: U3.13 26.54,63.37 22.99,63.37 SV3.2
N$117
  Top 0.305: U3.14 28.57,60.33 22.48,60.33 20.45,62.36 20.45,63.37 SV3.4
N$118
  Top 0.305: U3.15 29.84,59.56 20.7,59.56 17.91,62.36 17.91,63.37 SV3.6
N$119
  Top 0.305: U3.16 31.11,66.17 16.89,66.17 15.37,64.64 15.37,63.63 SV3.8
N$120  (via drill 0.51)
  Top 0.305: v32.38,59.82 U3.17
  Bottom 0.305: v32.38,59.82 34.67,59.82 34.67,61.34 34.16,61.85 23.5,61.85 23.24,61.59 12.83,61.59 12.83,63.37 SV3.10
N$121  (via drill 0.51)
  Top 0.305: v33.66,60.83 U3.18
  Bottom 0.305: v33.66,60.83 10.29,60.83 10.29,63.37 SV3.12
N$122  (via drill 0.51)
  Top 0.305: U3.19 34.92,63.88 34.67,63.88 v34.16,64.39
  Bottom 0.305: v34.16,64.39 24,64.39 24,64.64 23.24,65.41 7.75,65.41 7.75,63.63 SV3.14
N$123  (via drill 0.51)
  Top 0.305: U3.20 36.2,64.9 v35.43,64.9
  Bottom 0.305: v35.43,64.9 34.16,66.17 5.21,66.17 5.21,63.63 SV3.16
N$126
  Top 0.305: R8.2 99.19,7.49 95.12,7.49 94.11,6.48 94.11,5.46 U7.23
N$142  (via drill 0.51)
  Top 0.305: U4.5 36.2,56.01 v35.43,56.01
  Bottom 0.305: v35.43,56.01 26.04,56.01 26.04,53.47 25.27,52.7 SV4.1
N$143
  Top 0.305: U4.6 34.92,50.16 21.97,50.16 20.45,51.69 20.45,52.7 SV4.3
N$144
  Top 0.305: R9.2 99.19,27.81 97.41,26.04 94.61,26.04 94.11,25.53 94.11,24.51 U8.23
N$145  (via drill 0.51)
  Top 0.305: U4.7 33.66,52.45 32.38,51.18 v31.62,51.18
  Bottom 0.305: v31.62,51.18 29.84,49.4 11.56,49.4 11.56,53.98 12.06,54.48 17.65,54.48 17.65,52.7 SV4.5
N$146
  Top 0.305: U4.8 32.38,56.01 17.65,56.01 15.37,53.72 15.37,52.7 SV4.7
N$147  (via drill 0.51)
  Top 0.305: U4.10 29.84,52.7 28.32,51.18 v25.53,51.18
  Bottom 0.305: v25.53,51.18 23.75,51.18 23.5,50.93 18.92,50.93 18.92,54.23 17.91,55.24 10.29,55.24 10.29,52.7 SV4.11
N$148  (via drill 0.51)
  Top 0.305: U4.9 31.11,52.2 30.86,52.2 v30.35,51.69
  Bottom 0.305: v30.35,51.69 29.84,51.69 28.32,50.16 12.83,50.16 12.83,52.7 SV4.9
N$149  (via drill 0.51)
  Top 0.305: U4.11 28.57,52.45 28.32,52.45 27.81,51.94 26.54,51.94 v26.29,52.2
  Bottom 0.305: v26.29,52.2 29.34,52.2 29.84,52.7 32.64,52.7 32.64,50.67 30.61,48.64 7.75,48.64 7.75,52.7 SV4.13
N$150  (via drill 0.51)
  Top 0.305: v25.02,53.98 27.05,53.98 27.3,53.72 U4.12
  Bottom 0.305: v25.02,53.98 24,53.98 21.97,56.01 5.21,56.01 5.21,52.7 SV4.15
N$151
  Top 0.305: SV4.2 26.54,45.09 27.3,44.32 U4.13
N$152
  Top 0.305: U4.14 28.57,41.78 22.73,41.78 20.45,44.07 20.45,45.09 SV4.4
N$153
  Top 0.305: U4.15 29.84,41.02 20.95,41.02 17.91,44.07 17.91,45.09 SV4.6
N$154
  Top 0.305: U4.16 31.11,47.62 16.89,47.62 15.37,46.1 15.37,45.09 SV4.8
N$155  (via drill 0.51)
  Top 0.305: U4.17 32.38,42.29 v31.37,42.29
  Bottom 0.305: v31.37,42.29 12.83,42.29 12.83,45.09 SV4.10
N$156  (via drill 0.51)
  Top 0.305: v33.66,46.35 U4.18
  Bottom 0.305: v33.66,46.35 31.88,46.35 31.88,46.86 30.86,47.88 10.29,47.88 10.29,45.09 SV4.12
N$157  (via drill 0.51)
  Top 0.305: v34.92,46.1 U4.19
  Bottom 0.305: v34.92,46.1 33.66,44.83 31.11,44.83 31.11,46.61 30.61,47.12 11.3,47.12 11.3,43.81 10.79,43.31 7.75,43.31 7.75,45.09 SV4.14
N$158  (via drill 0.51)
  Top 0.305: U4.20 36.2,41.78 v35.43,41.78
  Bottom 0.305: v35.43,41.78 32.38,41.78 31.88,41.27 5.21,41.27 5.21,45.09 SV4.16
N$159  (via drill 0.51)
  Top 0.305: v76.83,55.5 90.3,55.5 90.3,52.96 U9.5
  Bottom 0.305: SV9.1 v76.83,55.5
N$160
  Top 0.305: SV9.3 74.3,51.18 76.07,49.4 89.03,49.4 89.03,52.96 U9.6
N$161  (via drill 0.51)
  Top 0.305: v87.5,51.18 87.5,52.96 U9.7
  Bottom 0.305: v87.5,51.18 85.22,48.9 71.75,48.9 SV9.5
N$162
  Top 0.305: R10.2 99.19,45.59 95.12,45.59 94.11,44.58 94.11,43.56 U9.23
N$163  (via drill 0.51)
  Top 0.305: v85.98,51.18 86.23,51.18 86.23,52.96 U9.8
  Bottom 0.305: v85.98,51.18 80.64,56.52 79.38,56.52 77.85,58.04 57.78,58.04 57.78,50.93 58.55,50.16 60.33,50.16 60.33,53.21 61.09,53.98 69.22,53.98 SV9.7
N$164
  Top 0.305: SV9.11 64.14,52.96 65.91,54.74 74.8,54.74 75.06,54.48 83.69,54.48 83.69,52.96 U9.10
N$165  (via drill 0.51)
  Top 0.305: v84.2,51.18 84.96,51.94 84.96,52.96 U9.9 | v72.77,49.91 72.26,49.4 68.45,49.4 66.67,51.18 SV9.9
  Bottom 0.305: v84.2,51.18 82.93,49.91 v72.77,49.91
N$166  (via drill 0.51)
  Top 0.305: v82.42,51.18 82.42,52.96 U9.11
  Bottom 0.305: v82.42,51.18 78.11,51.18 78.11,54.48 77.85,54.74 77.85,56.01 77.34,56.52 70.48,56.52 70.48,50.93 69.72,50.16 61.59,50.16 SV9.13
N$167  (via drill 0.51)
  Top 0.305: v80.14,53.47 80.64,53.47 81.15,52.96 U9.12
  Bottom 0.305: v80.14,53.47 78.61,54.99 78.61,56.26 77.6,57.28 59.05,57.28 SV9.15
N$168
  Top 0.305: U9.13 81.15,43.56 80.39,44.32 76.83,44.32 SV9.2
N$169
  Top 0.305: SV9.4 74.3,43.56 76.58,41.27 82.68,41.27 82.68,43.56 U9.14
N$170
  Top 0.305: SV9.6 71.75,43.56 74.8,40.51 83.95,40.51 83.95,43.56 U9.15
N$171
  Top 0.305: SV9.8 69.22,45.34 70.99,47.12 85.22,47.12 85.22,43.56 U9.16
N$172
  Top 0.305: SV9.10 66.67,43.56 70.48,39.75 86.49,39.75 86.49,43.56 U9.17
N$173  (via drill 0.51)
  Top 0.305: v87.5,45.34 87.5,43.56 U9.18
  Bottom 0.305: v87.5,45.34 78.11,45.34 78.11,45.59 77.34,46.35 64.14,46.35 SV9.12
N$174  (via drill 0.51)
  Top 0.305: v88.77,41.78 88.77,43.56 U9.19
  Bottom 0.305: v88.77,41.78 61.59,41.78 SV9.14
N$175  (via drill 0.51)
  Top 0.305: v89.28,45.34 90.04,44.58 90.04,43.56 U9.20
  Bottom 0.305: v89.28,45.34 86.49,42.55 63.63,42.55 62.87,43.31 62.87,45.59 62.1,46.35 59.05,46.35 SV9.16
N$176  (via drill 0.51)
  Top 0.305: v78.87,73.28 90.3,73.28 90.3,70.74 U10.5
  Bottom 0.305: v78.87,73.28 76.83,71.25 SV10.1
N$177
  Top 0.305: SV10.3 74.3,69.72 76.07,67.94 89.03,67.94 89.03,70.74 U10.6
N$178  (via drill 0.51)
  Top 0.305: v87.5,68.96 87.5,70.74 U10.7 | v84.96,66.17 83.95,67.18 74.3,67.18 71.75,69.72 SV10.5
  Bottom 0.305: v87.5,68.96 87.25,68.71 87.25,68.45 v84.96,66.17
N$180
  Top 0.305: R11.2 99.95,64.14 99.44,63.63 95.38,63.63 94.11,62.36 94.11,61.34 U10.23
N$181  (via drill 0.51)
  Top 0.305: v86.23,68.96 86.23,70.74 U10.8 | v78.36,66.17 78.11,66.42 72.52,66.42 69.22,69.72 SV10.7
  Bottom 0.305: v86.23,68.96 83.44,66.17 v78.36,66.17
N$182  (via drill 0.51)
  Top 0.305: v83.69,68.96 83.69,70.74 U10.10
  Bottom 0.305: v83.69,68.96 80.64,72.01 80.64,74.04 79.63,75.06 64.14,75.06 SV10.11
N$183
  Top 0.305: SV10.9 66.67,71.25 68.45,73.03 77.6,73.03 78.36,72.26 84.96,72.26 84.96,70.74 U10.9
N$184  (via drill 0.51)
  Top 0.305: v81.66,68.96 82.42,69.72 82.42,70.74 U10.11
  Bottom 0.305: v81.66,68.96 77.6,68.96 76.58,67.94 57.78,67.94 57.78,71.5 58.55,72.26 61.59,72.26 SV10.13
N$185  (via drill 0.51)
  Top 0.305: v80.14,70.48 80.9,70.48 81.15,70.74 U10.12
  Bottom 0.305: v80.14,70.48 79.88,70.74 79.88,73.79 79.38,74.3 65.41,74.3 65.41,69.47 64.64,68.71 59.05,68.71 SV10.15
N$186
  Top 0.305: SV10.2 79.63,62.87 81.15,61.34 U10.13
N$187
  Top 0.305: SV10.4 74.3,62.1 77.34,59.05 82.68,59.05 82.68,61.34 U10.14
N$188
  Top 0.305: SV10.6 71.75,62.1 75.56,58.29 83.95,58.29 83.95,61.34 U10.15
N$189
  Top 0.305: SV10.8 69.22,63.63 70.99,65.41 77.6,65.41 77.85,65.15 85.22,65.15 85.22,61.34 U10.16
N$190  (via drill 0.51)
  Top 0.305: v86.23,59.56 86.23,61.34 U10.17 | v71.5,59.82 70.99,60.33 68.45,60.33 66.67,62.1 SV10.10
  Bottom 0.305: v86.23,59.56 71.5,59.56 v71.5,59.82
N$191  (via drill 0.51)
  Top 0.305: v87.76,64.14 87.76,61.34 U10.18
  Bottom 0.305: v87.76,64.14 78.87,64.14 76.83,66.17 64.14,66.17 SV10.12
N$192  (via drill 0.51)
  Top 0.305: v88.77,59.56 88.77,61.34 U10.19 | v63.88,59.31 61.59,61.59 SV10.14
  Bottom 0.305: v88.77,59.56 86.49,57.28 80.64,57.28 79.12,58.8 63.88,58.8 v63.88,59.31
N$193  (via drill 0.51)
  Top 0.305: v89.79,63.12 90.04,63.12 90.04,61.34 U10.20
  Bottom 0.305: v89.79,63.12 78.11,63.12 78.11,63.88 76.58,65.41 65.41,65.41 65.41,61.85 64.64,61.09 59.05,61.09 SV10.16
N$194  (via drill 0.51)
  Top 0.305: v76.83,92.33 77.09,92.08 90.3,92.08 90.3,89.79 U11.5
  Bottom 0.305: SV11.1 v76.83,92.33
N$195
  Top 0.305: SV11.3 74.3,88.01 76.07,86.23 89.03,86.23 89.03,89.79 U11.6
N$196  (via drill 0.51)
  Top 0.305: v87.5,88.01 87.5,89.79 U11.7
  Bottom 0.305: v87.5,88.01 87.25,87.76 87.25,87.5 85.47,85.72 71.75,85.72 SV11.5
N$197  (via drill 0.51)
  Top 0.305: v86.23,88.01 86.23,89.79 U11.8 | v78.87,93.09 78.61,93.34 v69.47,93.34
  Bottom 0.305: v86.23,88.01 85.22,87 82.68,87 82.68,89.28 v78.87,93.09 | v69.47,93.34 69.22,93.09 SV11.7
N$198
  Top 0.305: R12.2 99.95,83.19 99.44,82.68 95.38,82.68 94.11,81.41 94.11,80.39 U11.23
N$199  (via drill 0.51)
  Top 0.305: v81.66,87.76 82.68,87.76 83.69,88.77 83.69,89.79 U11.10 | v72.77,86.74 72.26,86.23 65.91,86.23 64.14,88.01 SV11.11
  Bottom 0.305: v81.66,87.76 78.11,87.76 77.09,86.74 v72.77,86.74
N$200  (via drill 0.51)
  Top 0.305: v84.71,88.01 84.96,88.01 84.96,89.79 U11.9 | v83.69,93.85 83.19,94.36 v66.42,94.36
  Bottom 0.305: v84.71,88.01 83.69,89.03 v83.69,93.85 | v66.42,94.36 66.67,94.11 SV11.9
N$201
  Top 0.305: SV11.13 61.59,89.79 63.37,91.57 74.8,91.57 75.06,91.31 82.42,91.31 82.42,89.79 U11.11
N$202  (via drill 0.51)
  Top 0.305: v80.14,90.3 80.64,90.3 81.15,89.79 U11.12 | v75.56,92.33 61.59,92.33 59.05,89.79 SV11.15
  Bottom 0.305: v80.14,90.3 77.85,92.58 77.85,92.84 77.34,93.34 75.56,93.34 v75.56,92.33
N$203
  Top 0.305: U11.13 81.15,80.39 80.39,81.15 76.83,81.15 SV11.2
N$204
  Top 0.305: SV11.4 74.3,80.39 76.58,78.11 82.68,78.11 82.68,80.39 U11.14
N$205
  Top 0.305: U11.15 83.95,80.39 83.95,77.09 73.79,77.09 71.5,79.38 71.5,81.15 71.75,81.15 SV11.6
N$206
  Top 0.305: SV11.8 69.22,82.17 70.99,83.95 85.22,83.95 85.22,80.39 U11.16
N$207  (via drill 0.51)
  Top 0.305: v86.23,82.17 86.23,80.39 U11.17
  Bottom 0.305: v86.23,82.17 78.11,82.17 78.11,82.42 75.82,84.71 70.23,84.71 69.72,85.22 66.67,85.22 SV11.10
N$208  (via drill 0.51)
  Top 0.305: v87.25,78.61 87.5,78.61 87.5,80.39 U11.18
  Bottom 0.305: v87.25,78.61 75.31,78.61 75.31,77.6 74.8,77.09 60.33,77.09 60.33,82.42 61.09,83.19 64.14,83.19 SV11.12
N$209  (via drill 0.51)
  Top 0.305: v88.77,78.61 88.77,80.39 U11.19
  Bottom 0.305: v88.77,78.61 87.76,79.63 77.6,79.63 77.34,79.38 75.56,79.38 75.56,82.42 74.8,83.19 70.48,83.19 70.48,80.14 69.72,79.38 61.59,79.38 SV11.14
N$210  (via drill 0.51)
  Top 0.305: v89.79,82.17 90.04,82.17 90.04,80.39 U11.20
  Bottom 0.305: v89.79,82.17 88.52,83.44 88.52,100.2 85.72,103 60.33,103 60.33,83.44 59.05,82.17 SV11.16
N$211  (via drill 0.51)
  Top 0.305: v90.04,110.11 90.04,108.33 U12.5
  Bottom 0.305: v90.04,110.11 83.44,110.11 83.44,110.62 80.64,113.41 76.83,113.41 SV12.1
N$212
  Top 0.305: SV12.3 74.3,108.84 76.07,110.62 89.03,110.62 89.03,108.33 U12.6
N$213
  Top 0.305: SV12.5 71.75,107.06 73.53,105.28 87.76,105.28 87.76,108.08 U12.7
N$214  (via drill 0.51)
  Top 0.305: v86.23,106.3 86.23,108.08 U12.8 | v80.14,112.39 79.12,111.38 71.75,111.38 69.22,108.84 SV12.7
  Bottom 0.305: v80.14,112.39 v86.23,106.3
N$215  (via drill 0.51)
  Top 0.305: v83.69,106.3 83.69,108.08 U12.10
  Bottom 0.305: v83.69,106.3 82.42,106.3 82.42,105.79 81.92,105.28 64.14,105.28 SV12.11
N$216
  Top 0.305: R13.2 99.95,101.47 99.69,101.22 95.12,101.22 93.85,99.95 93.85,98.93 U12.23
N$217
  Top 0.305: U2.2 40.01,97.92 39.5,97.92 38.73,98.68 U1.22
N$218
  Top 0.305: U3.2 40.01,79.38 39.5,79.38 38.73,80.14 U2.22
N$219
  Top 0.305: U3.22 38.73,61.85 39.5,61.09 40.01,61.09 U4.2
N$220
  Top 0.305: U6.2 40.01,23.5 39.5,23.5 38.73,24.26 U5.22
N$221
  Top 0.305: U6.22 38.73,3.68 52.96,3.68 59.82,10.54 90.55,10.54 93.85,13.84 93.85,14.86 U7.2
N$222  (via drill 0.51)
  Top 0.305: v92.84,7.24 92.84,5.46 U7.22 | v94.11,32.13 94.11,33.91 U8.2
  Bottom 0.305: v92.84,7.24 94.11,8.51 v94.11,32.13
N$223  (via drill 0.51)
  Top 0.305: v93.85,45.85 92.84,45.85 92.84,43.56 U9.22 | v93.85,68.96 93.85,70.74 U10.2
  Bottom 0.305: v93.85,45.85 93.85,63.63 93.6,63.88 93.6,68.71 v93.85,68.96
N$224  (via drill 0.51)
  Top 0.305: v94.61,64.39 92.84,64.39 92.84,61.34 U10.22 | v94.61,88.01 93.85,88.77 93.85,89.79 U11.2
  Bottom 0.305: v94.61,64.39 94.87,64.64 94.87,87.76 v94.61,88.01
N$225  (via drill 0.51)
  Top 0.305: v93.85,82.68 92.84,82.68 92.84,80.39 U11.22 | v94.11,106.3 94.11,108.08 U12.2
  Bottom 0.305: v93.85,82.68 93.6,82.93 93.6,90.81 94.11,91.31 v94.11,106.3
N$226  (via drill 0.51)
  Top 0.305: v108.71,78.99 116.33,78.99 116.33,81.79 Q1.C
  Bottom 0.305: 103,76.71 103,25.53 102.49,25.02 102.49,22.48 102.87,22.1 | 103,76.71 103,78.99 | 103,78.99 103,79.12 | 103,21.97 102.87,22.1 | 103.12,79.25 103.12,78.99 103,78.99 | 102.87,22.1 102.87,20.83 107.19,16.51 SV14.1 | v108.71,78.99 106.43,76.71 103,76.71
N$227  (via drill 0.51)
  Top 0.305: v104.65,63.25 116.33,74.93 Q2.C
  Bottom 0.305: v104.65,63.25 104.65,21.59 109.73,16.51 SV14.3
N$228  (via drill 0.51)
  Top 0.305: v107.19,58.17 116.08,67.06 116.08,67.82 Q3.C
  Bottom 0.305: v107.19,58.17 107.19,41.15 108.46,39.88 108.46,20.32 112.27,16.51 SV14.5
N$229  (via drill 0.51)
  Top 0.305: v111.25,56.9 112.52,58.17 114.55,58.17 116.08,59.69 116.08,60.96 Q4.C
  Bottom 0.305: v111.25,56.9 110.24,55.88 110.24,30.99 111,30.23 111,23.11 111.51,22.61 111.51,19.81 114.81,16.51 SV14.7
N$230  (via drill 0.51)
  Top 0.305: v111.25,55.37 112.78,56.9 114.55,56.9 116.08,55.37 116.08,54.1 Q5.C
  Bottom 0.305: v111.25,55.37 111.25,30.99 113.54,28.7 113.54,23.11 114.05,22.61 114.05,19.81 117.35,16.51 SV14.9
N$231  (via drill 0.51)
  Top 0.305: v112.27,49.28 112.78,49.78 114.55,49.78 116.08,48.26 116.08,46.99 Q6.C
  Bottom 0.305: v112.27,49.28 112.27,30.99 116.08,27.18 116.08,23.11 116.59,22.61 116.59,19.81 119.89,16.51 SV14.11
N$232
  Top 0.305: R15.1 125.73,82.04 126.24,81.53 126.49,81.53 127.25,80.77 127.25,78.23 122.17,78.23 118.62,81.79 Q1.B
N$233
  Top 0.305: SV14.13 122.68,16.51 122.68,21.59 125.98,21.59 127.25,22.86 127.25,43.18 118.11,43.18 116.33,41.4 116.33,40.13 Q7.C
N$234
  Bottom 0.305: SV14.15 124.97,16.51 118.62,22.86 118.62,29.72 116.33,32 116.33,32.26 Q8.C
N$235
  Top 0.305: R29.1 125.73,34.8 121.41,34.8 119.13,32.51 118.87,32.51 Q8.B
N$236
  Top 0.305: R27.1 125.73,42.42 122.17,42.42 119.63,39.88 118.87,39.88 Q7.B
N$237
  Top 0.305: Q6.B 119.63,46.99 121.92,49.28 127.25,49.28 127.25,46.74 126.75,46.23 126.49,46.23 125.73,45.47 R25.1
N$238
  Top 0.305: R23.1 125.73,56.39 122.17,56.39 119.63,53.85 118.87,53.85 Q5.B
N$239
  Top 0.305: R21.1 125.73,63.25 121.92,63.25 119.63,60.96 Q4.B
N$240
  Top 0.305: R19.1 125.73,70.36 122.17,70.36 119.63,67.82 118.87,67.82 Q3.B
N$241
  Top 0.305: R17.1 125.73,77.22 121.92,77.22 119.63,74.93 Q2.B
N$242  (via drill 0.51)
  Top 0.305: v80.14,109.6 80.64,109.6 80.9,109.86 84.96,109.86 84.96,108.33 U12.9 | v77.85,112.39 77.85,113.92 71.75,113.92 66.67,108.84 SV12.9
  Bottom 0.305: v80.14,109.6 77.85,111.89 v77.85,112.39
N$243  (via drill 0.51)
  Top 0.305: SV13.15 120.52,110.62 113.67,110.62 v107.57,104.52 | 103,21.97 102.49,22.48 102.49,24.64 | 102.49,26.04 102.49,25.91 | 102.49,25.91 102.49,24.64 | 102.62,25.91 102.49,25.91 | 123.19,30.73 125.73,30.73 R29.2 | 102.49,24.64 104.39,24.64 105.92,26.16 | 105.92,26.16 109.22,29.46 120.4,29.46 121.67,30.73 123.19,30.73 | 123.19,30.73 R28.2 | v105.92,75.69 v105.92,77.72 | 105.92,26.16 v105.66,26.42
  Bottom 0.305: 109.86,102.23 109.73,102.36 | 109.73,102.36 v107.57,104.52 | 109.73,102.36 105.92,98.55 v105.92,77.72 | v105.92,75.69 105.66,75.44 v105.66,26.42
N$244
  Top 0.305: LED1.A 108.84,10.79 108.84,5.21 R1.1
N$245  (via drill 0.51)
  Top 0.305: 123.19,38.35 125.73,38.35 R27.2 | 123.19,38.35 121.92,37.08 112.78,37.08 v109.22,40.64 | 123.19,38.35 R26.2
  Bottom 0.305: SV13.13 118.24,101.73 118.24,94.36 115.95,92.08 113.16,92.08 113.16,88.39 | 113.16,88.39 113.16,88.27 | 113.16,88.39 113.03,88.39 110.74,86.11 110.74,79.5 108.2,76.96 108.2,41.66 v109.22,40.64
N$246  (via drill 0.51)
  Top 0.305: R25.2 125.73,47.24 125.48,47.24 124.46,46.23 123.95,46.23 123.19,45.47 R24.2 123.19,45.21 121.92,43.94 v109.22,43.94
  Bottom 0.305: 120.78,94.49 120.78,101.73 SV13.11 | 120.78,94.49 120.78,94.36 | 120.78,94.49 120.65,94.49 120.65,94.23 111.51,85.09 111.51,79.25 109.47,77.22 109.47,44.2 v109.22,43.94
N$247  (via drill 0.51)
  Top 0.305: v125.35,91.82 v125.35,89.79 125.09,89.79 124.84,89.53 124.84,88.39 | 124.84,88.39 124.84,88.01 | v119.13,86.87 123.7,86.87 124.46,87.63 124.46,88.39 124.84,88.39 | 123.19,52.32 125.73,52.32 R23.2 | 123.19,52.32 121.67,50.8 v112.52,50.8 | 123.19,52.32 R22.2
  Bottom 0.305: v125.35,91.82 124.33,92.84 124.33,99.19 SV13.9 | 124.84,88.01 124.84,89.28 v125.35,89.79 | v112.52,50.8 112.27,51.05 112.27,83.31 115.82,86.87 v119.13,86.87
N$248  (via drill 0.51)
  Top 0.305: 125.86,88.77 125.6,88.77 | 125.86,88.77 126.36,89.28 126.36,98.17 123.83,98.17 123.57,98.42 SV13.7 | 125.86,88.77 v125.86,88.52 125.98,88.39 127.25,88.39 127.25,87.38 125.22,85.34 v121.16,85.34 | 123.19,59.44 125.73,59.44 R21.2 | v120.4,59.44 123.19,59.44 | 123.19,59.44 R20.2
  Bottom 0.305: 125.6,87.76 126.11,88.27 v125.86,88.52 | v120.4,59.44 120.14,59.69 120.14,84.33 v121.16,85.34
N$249  (via drill 0.51)
  Top 0.305: 111.12,88.01 115.44,88.01 117.47,90.04 | 117.47,90.04 120.02,92.58 120.02,95.63 121.28,95.63 121.54,95.89 SV13.5 | 119.63,88.77 118.75,88.77 117.47,90.04 | 119.63,88.77 121.54,88.77 | 121.54,88.77 122.3,88.77 | v123.32,88.01 123.06,88.27 122.05,88.27 121.54,88.77 | v119.63,88.65 119.63,88.77 | R18.2 123.19,66.29 125.73,66.29 R19.2 125.73,66.55 126.24,67.06 v127.25,67.06
  Bottom 0.305: v127.25,67.06 123.44,70.87 123.44,87.88 v123.32,88.01
N$250  (via drill 0.51)
  Top 0.305: 125.73,73.41 123.19,73.41 R16.2 | 125.73,73.41 126.49,74.17 v127.25,74.17 | 125.73,73.41 R17.2
  Bottom 0.305: 124.33,90.81 125.86,90.81 126.75,89.92 126.87,89.79 127,89.66 127,74.42 v127.25,74.17 | 124.33,90.81 124.33,91.57 SV13.3 120.65,91.44 | 123.32,89.28 124.33,90.3 124.33,90.81
N$251  (via drill 0.51)
  Top 0.305: 119,90.55 121.28,90.55 121.54,90.81 SV13.1 | R15.2 125.73,80.26 123.19,80.26 R14.2 123.19,80.52 122.94,80.77 121.41,80.77 120.4,81.79 120.4,83.31 120.9,83.82 v121.16,83.82
  Bottom 0.305: v121.16,83.82 122.17,84.84 122.17,90.42 SV13.1 122.3,90.55
N$252  (via drill 0.51)
  Top 0.305: v81.41,106.3 82.42,106.3 82.42,108.08 U12.11
  Bottom 0.305: v81.41,106.3 77.6,106.3 77.34,106.05 75.56,106.05 75.56,109.09 74.04,110.62 57.78,110.62 57.78,106.81 58.55,106.05 61.59,106.05 SV12.13
N$253  (via drill 0.51)
  Top 0.305: U12.12 79.12,106.05 73.79,106.05 73.03,106.81 v73.03,109.35
  Bottom 0.305: v73.03,109.35 72.52,109.86 59.05,109.86 SV12.15
N$254
  Top 0.305: U12.13 79.88,100.2 76.83,100.2 SV12.2
N$255
  Top 0.305: SV12.4 74.3,101.22 75.31,102.23 81.15,102.23 82.42,100.97 82.42,98.93 U12.14
N$256
  Top 0.305: SV12.6 71.75,101.22 73.53,103 81.41,103 83.69,100.71 83.69,98.93 U12.15
N$257  (via drill 0.51)
  Top 0.305: v84.96,100.71 84.96,98.93 U12.16 | v79.63,98.17 79.38,97.92 70.99,97.92 69.22,99.69 SV12.8
  Bottom 0.305: v84.96,100.71 81.66,100.71 81.66,100.2 v79.63,98.17
N$258  (via drill 0.51)
  Top 0.305: v86.49,100.71 86.49,98.93 U12.17
  Bottom 0.305: v86.49,100.71 86.23,100.46 86.23,100.2 80.14,94.11 70.48,94.11 70.48,87.76 69.72,87 67.94,87 67.94,94.36 66.67,95.63 SV12.10
N$259  (via drill 0.51)
  Top 0.305: v84.2,101.73 87.76,101.73 87.76,98.93 U12.18
  Bottom 0.305: v84.2,101.73 81.66,101.73 74.8,94.87 68.45,94.87 68.45,98.68 67.94,99.19 67.94,101.47 67.18,102.23 64.14,102.23 SV12.12
N$260
  Top 0.305: SV12.14 61.59,99.44 62.61,98.42 69.47,98.42 70.74,97.16 88.77,97.16 88.77,98.68 U12.19
N$261
  Top 0.305: SV12.16 59.05,99.44 60.83,97.66 69.22,97.66 70.48,96.39 90.3,96.39 90.3,98.68 U12.20
SDI_B  (via drill 0.51)
  Top 0.305: v94.87,55.24 94.11,55.24 94.11,52.96 U9.2
  Bottom 0.305: v94.87,55.24 97.41,57.78 97.41,103.76 99.19,105.54 113.16,105.54 113.16,105.28 SV13.12
SDI_G  (via drill 0.51)
  Top 0.305: U5.2 40.01,36.96 v47.62,36.96 | v89.79,74.55 90.3,75.06 96.9,75.06 v110.87,89.03
  Bottom 0.305: v47.62,36.96 57.02,46.35 57.02,63.12 61.09,67.18 83.44,67.18 85.22,68.96 85.22,69.98 v89.79,74.55 | v110.87,89.03 112.39,90.55 112.39,98.42 SV13.10
SDI_R  (via drill 0.51)
  Top 0.305: v40.01,110.62 U1.2
  Bottom 0.305: v40.01,110.62 57.02,110.62 57.02,106.55 59.05,104.52 90.55,104.52 90.55,106.81 91.06,107.31 116.71,107.31 116.71,100.2 SV13.8
~OE  (via drill 0.51)
  Top 0.305: v37.47,8 U6.21 | v36.45,27.05 37.47,26.04 U5.21 | U3.21 37.47,60.33 v36.7,60.33 | U2.21 37.47,78.61 v36.45,78.61 | U1.21 37.47,97.16 v36.7,97.16 | 91.57,24.51 91.57,23.5 92.84,22.23 96.9,22.23 96.9,13.59 93.85,10.54 91.57,10.54 91.57,5.46 U7.21 | 91.57,41.27 91.57,36.2 95.89,36.2 96.9,35.18 96.9,28.57 94.61,28.57 91.57,25.53 91.57,24.51 | 91.57,41.27 91.57,43.56 U9.21 | 91.57,24.51 U8.21 | v90.81,59.05 91.57,59.05 91.57,61.34 U10.21 | v90.81,41.53 91.06,41.27 91.57,41.27 | v90.81,78.11 91.57,78.11 91.57,80.39 U11.21 | 91.57,95.89 91.57,95.38 v90.81,95.38 | 91.57,95.89 91.57,98.68 U12.21 | 91.57,95.89 SV13.6 | U4.21 37.47,46.61 v36.45,46.61
  Bottom 0.305: v37.47,8 36.45,9.02 v36.45,27.05 v36.45,46.61 36.45,60.07 | 36.45,60.07 v36.45,78.61 36.45,96.9 v36.7,97.16 36.45,97.41 36.45,107.57 36.96,108.08 56.26,108.08 56.26,106.3 58.8,103.76 90.81,103.76 v90.81,95.38 v90.81,78.11 v90.81,59.05 v90.81,41.53 | 36.45,60.07 v36.7,60.33

## Text on the board
_tsilk: RGB DRIVER REVA / MDILLMANN | +3V3